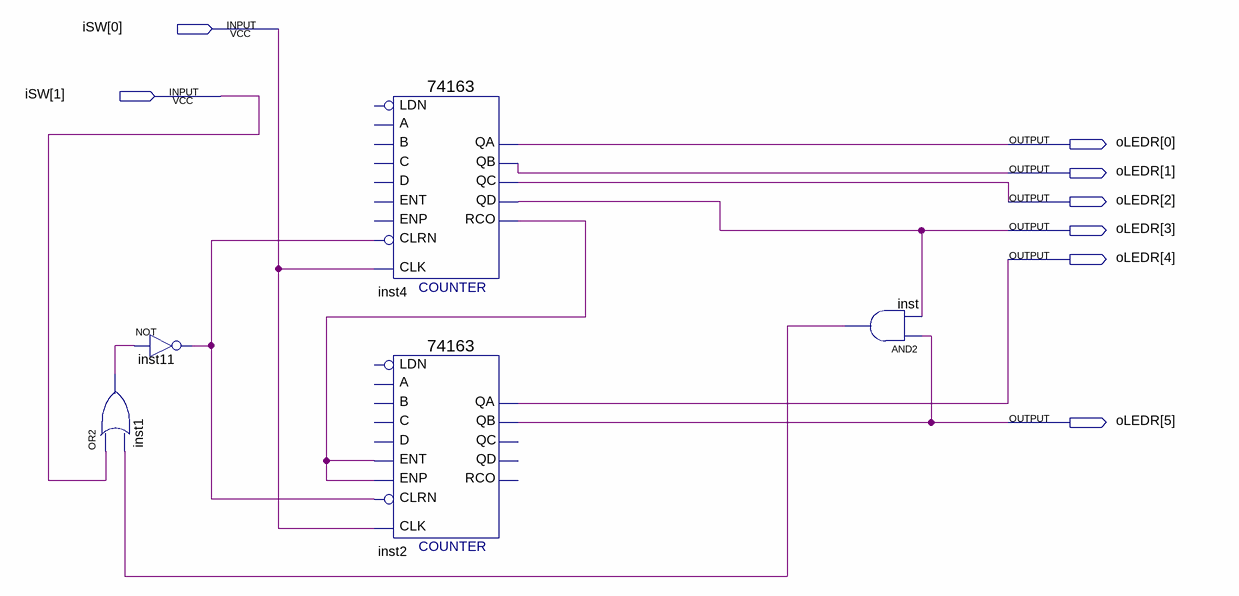
[diagram p0: schematic sheet]
// Quartus schematic L74163.bdf as structural Verilog: 5 symbols, 8 pins
module L74163 (
  input  [1:0] iSW,
  output [5:0] oLEDR
);

  wire inst1_out, inst4_rco, inst11_out, inst_out;

  or inst1 (inst1_out, iSW[1], inst_out);
  not inst11 (inst11_out, inst1_out);
  \74163  inst4 (
    .CLRN(inst11_out), .CLK(iSW[0]), .QA(oLEDR[0]), .QB(oLEDR[1]), .QC(oLEDR[2]), .QD(oLEDR[3]),
    .RCO(inst4_rco));  // open: C, B, A, ENT, D, ENP, LDN
  \74163  inst2 (
    .ENT(inst4_rco), .CLRN(inst11_out), .CLK(iSW[0]), .ENP(inst4_rco), .QA(oLEDR[4]), .QB(oLEDR[5]));  // open: C, B, A, D, LDN, QC, QD, RCO
  and inst (inst_out, oLEDR[5], oLEDR[3]);
endmodule
